# EasyEDA schematic SCH_Project2_2025-11-09.json
TITLE: Total (high side switch) ProMicro, +Tempsensor; REV: 1.0; Date: 2025-10-28; Sheet: 1/1; Drawn By: corlov; Company: Your Company
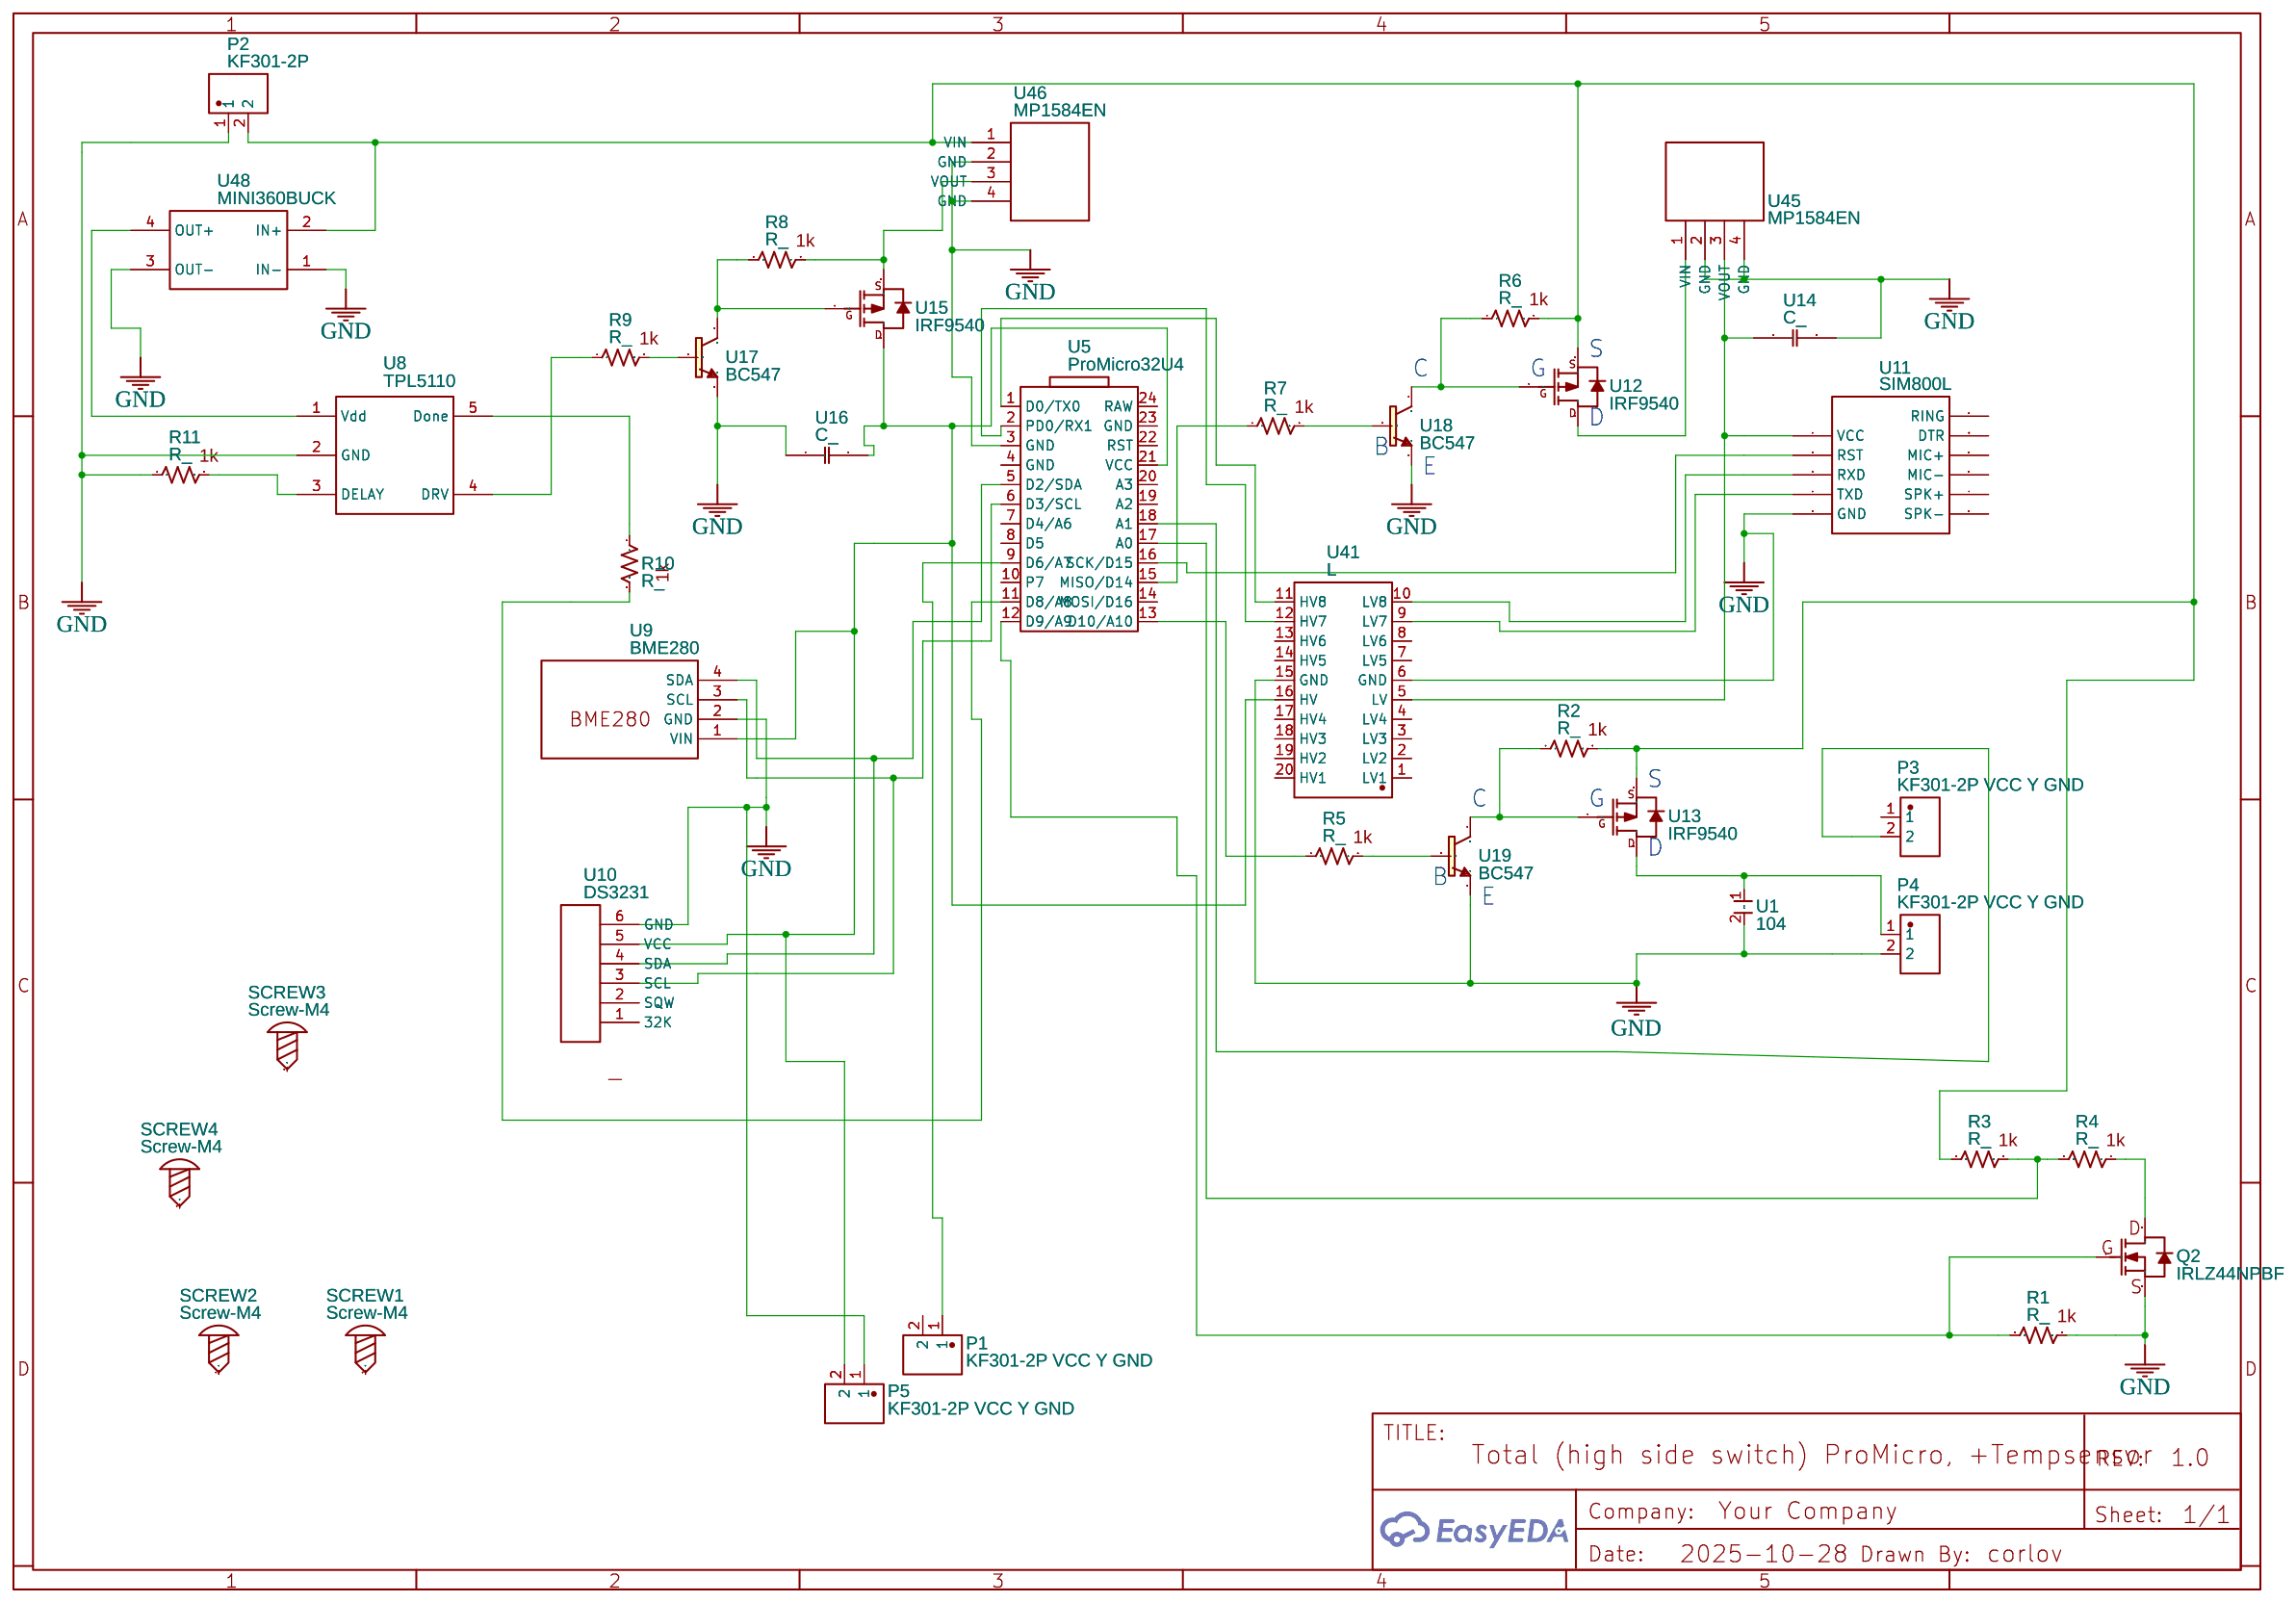
[diagram p0: schematic sheet]

## Parts
P1  KF301-2P VCC Y GND  [CONN-TH_XY301V-A-5.0-2P]
P2  KF301-2P  [CONN-TH_XY301V-A-5.0-2P]
P3  KF301-2P VCC Y GND  [CONN-TH_XY301V-A-5.0-2P]
P4  KF301-2P VCC Y GND  [CONN-TH_XY301V-A-5.0-2P]
P5  KF301-2P VCC Y GND  [CONN-TH_XY301V-A-5.0-2P]
Q2  IRLZ44NPBF  [TO-220-3 (IRLZ44NPBF)_L10.0-W4.5-P2.54-L]
R1  R_  [TH_RESISTOR]
R2  R_  [TH_RESISTOR]
R3  R_  [TH_RESISTOR]
R4  R_  [TH_RESISTOR]
R5  R_  [TH_RESISTOR]
R6  R_  [TH_RESISTOR]
R7  R_  [TH_RESISTOR]
R8  R_  [TH_RESISTOR]
R9  R_  [TH_RESISTOR]
R10  R_  [TH_RESISTOR]
R11  R_  [TH_RESISTOR]
SCREW1  Screw-M4  [SCREW-M4]
SCREW2  Screw-M4  [SCREW-M4]
SCREW3  Screw-M4  [SCREW-M4]
SCREW4  Screw-M4  [SCREW-M4]
U1  104  [104]
U5  ProMicro32U4  [ARDUINOPROMICRO-PWB]
U8  TPL5110  [TPL5110]
U9  BME280  [BME280]
U10  DS3231  [DS3231]
U11  SIM800L  [SIM800L]
U12  IRF9540  [IRF9540]
U13  IRF9540  [IRF9540]
U14  C_  [C_]
U15  IRF9540  [IRF9540]
U16  C_  [C_]
U17  BC547  [BC547 (2)]
U18  BC547  [BC547 (2)]
U19  BC547  [BC547 (2)]
U41  L  [MPN-TH-20_L28.0-W14.0-P2.54-BL]
U45  MP1584EN  [MP1584EN]
U46  MP1584EN  [MP1584EN]
U48  MINI360BUCK  [MINI360BUCK]

## Library data of the parts
P1-P5 = KF301-2P VCC Y GND: Contributor: lcsc; Supplier: LCSC; Supplier Part: C9900016950; Manufacturer: null; Manufacturer Part: KF301-2P接线端子; JLCPCB Part Class: Extended Part
Q2 = IRLZ44NPBF: Supplier: LCSC; Manufacturer: Infineon(英飞凌); Supplier Part: C38774; JLCPCB Part Class: Extended Part; Contributor: ARNABMACH0
R1-R11 = R_: Contributor: hanrelauwrens
SCREW1-SCREW4 = Screw-M4: Contributor: EasyEDA
U1 = 104: Manufacturer: Fe; Contributor: Guest
U5 = ProMicro32U4: Manufacturer: generic; Manufacturer Part: generic; Supplier Part: undefined; Contributor: pbinsted
U8 = ADAFRUIT TPL5110 BREAKOUT: Manufacturer Part: 3435; Supplier Part: 3435; Supplier: Adafruit; link: https://learn.adafruit.com/adafruit-tpl5110-power-timer-breakout?view=all; Contributor: Sdobout
U9 = BME280: Contributor: allvex
U10 = DS3231 upright: Contributor: poljak1141leonardo
U11 = SIM800L: Contributor: Rafa_2122
U12 U13 U15 = IRF9540: Contributor: alesmo
U14 U16 = C_: Contributor: verdenum
U17-U19 = BC547: Contributor: joaodahlke
U41 = LEVEL CONVERTER 8: Contributor: LCSC; Supplier: LCSC; Supplier Part: C2829587; Manufacturer: null; Manufacturer Part: Level Converter 8; JLCPCB Part Class: Extended Part
U45 U46 = MP1584EN: Contributor: babeinlovexd
U48 = MINI360BUCK: Contributor: Andrey Fedorov; sourceId: FRLFXR8qI; Manufacturer Part: Mini360; link: http://ali.pub/399f0z

## Nets
GND: P2.1 P4.2 P5.1 Q2.3(S) R1.2 R11.1 U1.2 U5.3(GND) U8.2(GND) U9.2(GND) U10.6(GND) U11.5(GND) U14.2 U16.1 U17.3(E) U18.3(E) U19.3(E) U41.6(GND) U41.15(GND) U45.2(GND) U45.4(GND) U46.2(GND) U46.4(GND) U48.1(IN-) U48.3(OUT-)
Net-(P1-1): P1.1 U5.9(D6/A7)
Net-(P2-2): P2.2 R2.2 R3.1 R6.2 U12.3(S) U13.3(S) U46.1(VIN) U48.2(IN+)
Net-(P3-2): P3.2 U5.18(A1)
Net-(P4-1): P4.1 U1.1 U13.2(D)
Net-(P5-2): P5.2 U5.21(VCC) U9.1(VIN) U10.5(VCC) U15.2(D) U16.2 U41.16(HV)
Net-(Q2-1): Q2.1(G) R1.1 U5.12(D9/A9)
Net-(Q2-2): Q2.2(D) R4.2
Net-(R2-1): R2.1 U13.1(G) U19.1(C)
Net-(R3-2): R3.2 R4.1 U5.17(A0)
Net-(R5-1): R5.1 U5.13(D10/A10)
Net-(R5-2): R5.2 U19.2(B)
Net-(R6-1): R6.1 U12.1(G) U18.1(C)
Net-(R7-1): R7.1 U5.15(MISO/D14)
Net-(R7-2): R7.2 U18.2(B)
Net-(R8-1): R8.1 U15.1(G) U17.1(C)
Net-(R8-2): R8.2 U15.3(S) U46.3(VOUT)
Net-(R9-1): R9.1 U8.4(DRV)
Net-(R9-2): R9.2 U17.2(B)
Net-(R10-1): R10.1 U8.5(Done)
Net-(R10-2): R10.2 U5.11(D8/A8)
Net-(R11-2): R11.2 U8.3(DELAY)
Net-(U5-1): U5.1(D0/TX0) U41.11(HV8)
Net-(U5-2): U5.2(PD0/RX1) U41.12(HV7)
Net-(U5-5): U5.5(D2/SDA) U9.4(SDA) U10.4(SDA)
Net-(U5-6): U5.6(D3/SCL) U9.3(SCL) U10.3(SCL)
Net-(U5-16): U5.16(SCK/D15) U11.2(RST)
Net-(U8-1): U8.1(Vdd) U48.4(OUT+)
Net-(U11-1): U11.1(VCC) U14.1 U41.5(LV) U45.3(VOUT)
Net-(U11-3): U11.3(RXD) U41.10(LV8)
Net-(U11-4): U11.4(TXD) U41.9(LV7)
Net-(U12-2): U12.2(D) U45.1(VIN)

Not connected (* = marked no-connect by the designer): P1 2; P3 1; SCREW1 1; SCREW2 1; SCREW3 1; SCREW4 1; U5 4(GND) 7(D4/A6) 8(D5) 10(P7) 14(MOSI/D16) 19(A2) 20(A3) 22(RST) 23(GND) 24(RAW); U10 1(32K) 2(SQW); U11 6(SPK-) 7(SPK+) 8(MIC-) 9(MIC+) 10(DTR) 11(RING); U41 1(LV1) 2(LV2) 3(LV3) 4(LV4) 7(LV5) 8(LV6) 13(HV6) 14(HV5) 17(HV4) 18(HV3) 19(HV2) 20(HV1)

## Notes on the sheet
- S
- C
- G
- D
- B
- E
- S
- C
- G
- D
- B
- E
